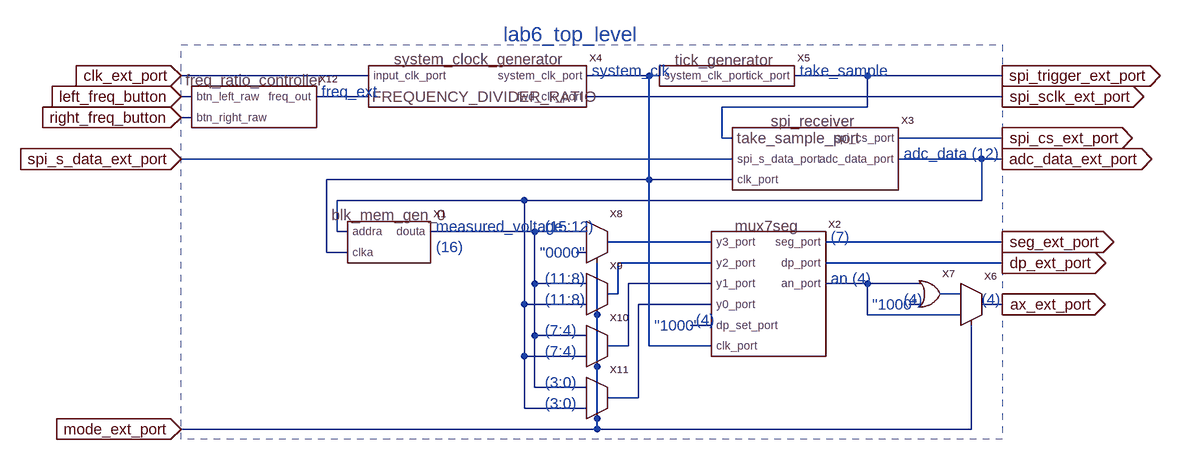
[diagram p0: schematic lab6_top_level.asc]
lab6_top_level.asc, the LTspice schematic file:
Version 4
SHEET 1 928 892
WIRE -224 112 -512 112
WIRE 208 112 112 112
WIRE 224 112 208 112
WIRE 544 112 432 112
WIRE 752 112 544 112
WIRE -496 144 -512 144
WIRE -224 144 -304 144
WIRE 752 144 112 144
WIRE 544 160 544 112
WIRE 544 160 320 160
WIRE -496 176 -512 176
WIRE 320 208 320 160
WIRE 336 208 320 208
WIRE 752 208 592 208
WIRE 336 240 -512 240
WIRE 720 240 592 240
WIRE 752 240 720 240
WIRE 208 272 208 112
WIRE 208 272 -288 272
WIRE 336 272 208 272
WIRE 16 304 -272 304
WIRE 720 304 720 240
WIRE 720 304 16 304
WIRE -272 352 -272 304
WIRE -256 352 -272 352
WIRE 32 352 -128 352
WIRE 112 352 32 352
WIRE 304 368 144 368
WIRE 752 368 480 368
WIRE -288 384 -288 272
WIRE -256 384 -288 384
WIRE 112 384 96 384
WIRE 304 400 160 400
WIRE 752 400 480 400
WIRE 32 432 32 352
WIRE 112 432 32 432
WIRE 304 432 176 432
WIRE 544 432 480 432
WIRE 624 432 544 432
WIRE 160 448 160 400
WIRE 160 448 144 448
WIRE 688 448 656 448
WIRE 16 464 16 304
WIRE 112 464 16 464
WIRE 304 464 192 464
WIRE 624 464 608 464
WIRE 752 464 720 464
WIRE 128 480 128 400
WIRE 544 480 544 432
WIRE 688 480 544 480
WIRE 304 496 272 496
WIRE 32 512 32 432
WIRE 112 512 32 512
WIRE 176 528 176 432
WIRE 176 528 144 528
WIRE 208 528 208 272
WIRE 304 528 208 528
WIRE 16 544 16 464
WIRE 112 544 16 544
WIRE 128 560 128 480
WIRE 32 592 32 512
WIRE 112 592 32 592
WIRE 192 608 192 464
WIRE 192 608 144 608
WIRE 16 624 16 544
WIRE 112 624 16 624
WIRE 128 640 128 560
WIRE 128 656 128 640
WIRE 128 656 -512 656
WIRE 704 656 704 496
WIRE 704 656 128 656
FLAG -512 112 clk_ext_port
IOPIN -512 112 In
FLAG 752 208 spi_cs_ext_port
IOPIN 752 208 Out
FLAG 752 144 spi_sclk_ext_port
IOPIN 752 144 Out
FLAG -512 240 spi_s_data_ext_port
IOPIN -512 240 In
FLAG 752 112 spi_trigger_ext_port
IOPIN 752 112 Out
FLAG -512 656 mode_ext_port
IOPIN -512 656 In
FLAG 752 368 seg_ext_port
IOPIN 752 368 Out
FLAG 752 400 dp_ext_port
IOPIN 752 400 Out
FLAG 752 240 adc_data_ext_port
IOPIN 752 240 Out
FLAG 752 464 ax_ext_port
IOPIN 752 464 Out
FLAG -512 144 left_freq_button
IOPIN -512 144 In
FLAG -512 176 right_freq_button
IOPIN -512 176 In
SYMBOL blk_mem_gen_0 -192 368 R0
SYMATTR InstName X1
SYMBOL mux7seg 384 400 R0
SYMATTR InstName X2
SYMBOL spi_receiver 464 240 R0
SYMATTR InstName X3
SYMBOL system_clock_generator -64 128 R0
SYMATTR InstName X4
SYMBOL tick_generator 320 112 R0
SYMATTR InstName X5
SYMBOL mux_2_to_1 720 464 R0
SYMATTR InstName X6
SYMBOL or_2_input 640 448 R0
SYMATTR InstName X7
SYMBOL mux_2_to_1 144 368 R0
SYMATTR InstName X8
SYMBOL mux_2_to_1 144 448 R0
SYMATTR InstName X9
SYMBOL mux_2_to_1 144 528 R0
SYMATTR InstName X10
SYMBOL mux_2_to_1 144 608 R0
SYMATTR InstName X11
SYMBOL freq_ratio_controller -400 144 R0
SYMATTR InstName X12
TEXT 120 104 Left 2 ;system_clk
TEXT 440 104 Left 2 ;take_sample
TEXT 600 232 Left 2 ;adc_data (12)
TEXT -120 344 Left 2 ;measured_voltage \n(16)
TEXT 48 344 Left 2 ;(15:12)
TEXT 48 424 Left 2 ;(11:8)
TEXT 48 504 Left 2 ;(7:4)
TEXT 48 584 Left 2 ;(3:0)
TEXT 216 496 Left 2 ;"1000"
TEXT 280 488 Left 2 ;(4)
TEXT 488 424 Left 2 ;an (4)
TEXT 552 464 Left 2 ;"1000"
TEXT 88 48 Center 3 ;lab6_top_level
TEXT 40 384 Left 2 ;"0000"
TEXT 48 456 Left 2 ;(11:8)
TEXT 48 536 Left 2 ;(7:4)
TEXT 48 616 Left 2 ;(3:0)
TEXT 720 456 Left 2 ;(4)
TEXT -296 136 Left 2 ;freq_ext
TEXT 600 456 Left 2 ;(4)
TEXT 488 360 Left 2 ;(7)
RECTANGLE Normal 752 672 -512 64 2

The netlist it stands for:
* lab6_top_level.asc
XX1 adc_data_ext_port N001 N003 blk_mem_gen_0  ; pins addra clka douta
XX2 N004 N006 N007 N010 N012 N001 seg_ext_port dp_ext_port N008 mux7seg  ; pins y3_port y2_port y1_port y0_port dp_set_port clk_port seg_port dp_port an_port
XX3 N001 spi_trigger_ext_port spi_s_data_ext_port spi_cs_ext_port adc_data_ext_port spi_receiver  ; pins clk_port take_sample spi_s_data_port spi_cs_port adc_data_port
XX4 clk_ext_port N001 spi_sclk_ext_port N002 system_clock_generator  ; pins input_clk_port system_clk_port fwd_clk_port ?
XX5 N001 spi_trigger_ext_port tick_generator  ; pins system_clk_port tick_port
XX6 N009 N008 ax_ext_port mode_ext_port mux_2_to_1
XX7 N008 N011 N009 or_2_input
XX8 N003 N005 N004 mode_ext_port mux_2_to_1
XX9 N003 adc_data_ext_port N006 mode_ext_port mux_2_to_1
XX10 N003 adc_data_ext_port N007 mode_ext_port mux_2_to_1
XX11 N003 adc_data_ext_port N010 mode_ext_port mux_2_to_1
XX12 left_freq_button right_freq_button N002 freq_ratio_controller  ; pins btn_left_raw btn_right_raw freq_out
* system_clk
* take_sample
* adc_data (12)
* measured_voltage
* (16)
* (15:12)
* (11:8)
* (7:4)
* (3:0)
* "1000"
* (4)
* an (4)
* "1000"
* lab6_top_level
* "0000"
* (11:8)
* (7:4)
* (3:0)
* (4)
* freq_ext
* (4)
* (7)
.backanno
.end